# Altium schematic sheet Sensors.SchDoc
size A4; SheetNumber: 3; SheetTotal: 5
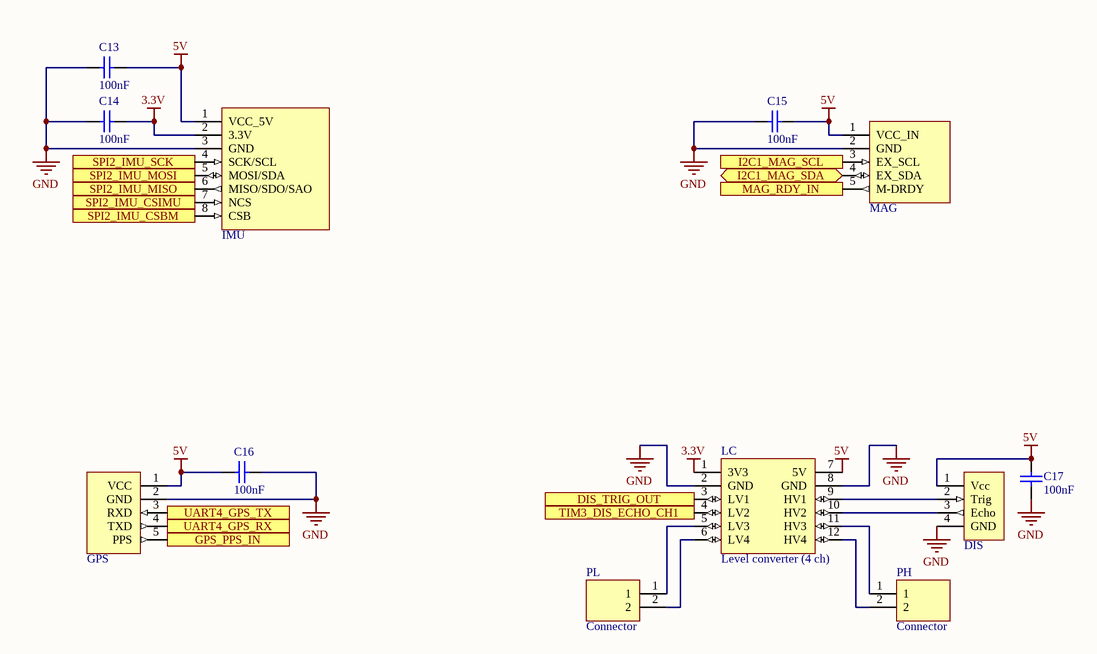
[diagram p0: Sensors.SchDoc]

## Parts
C13  100nF  [FP_0805_CAP_085]
C14  100nF  [FP_0805_CAP_085]
C15  100nF  [FP_0805_CAP_085]
C16  100nF  [FP_0805_CAP_085]
C17  100nF  [FP_0805_CAP_085]
DIS  Távolságérzékelő  [FP_CONN4_TUSKE_254MM]  (value not drawn)
GPS  GPS  [FP_CONN5_TUSKE_254MM]  (value not drawn)
IMU  IMU + Barométer  [GY-91]  (value not drawn)
LC  Level converter (4 ch)  [Level converter (4 ch)]
MAG  Iránytű, magnetométer  [GY-271]  (value not drawn)
PH  Connector  [FP_CONN2_TUSKE_254MM]
PL  Connector  [FP_CONN2_TUSKE_254MM]

## Ports
DIS_TRIG_OUT (in), GPS_PPS_IN (out), I2C1_MAG_SCL (in), I2C1_MAG_SDA (bidir), MAG_RDY_IN (out), SPI2_IMU_CSBM (in), SPI2_IMU_CSIMU (in), SPI2_IMU_MISO (out), SPI2_IMU_MOSI (in), SPI2_IMU_SCK (in), TIM3_DIS_ECHO_CH1 (out), UART4_GPS_RX (out), UART4_GPS_TX (in)

## Nets
3.3V: C14.2 IMU.2(3.3V) LC.1(3V3)
5V: C13.2 C15.2 C16.1 C17.2 DIS.1(Vcc) GPS.1(VCC) IMU.1(VCC_5V) LC.7(5V) MAG.1(VCC_IN)
GND: C13.1 C14.1 C15.1 C16.2 C17.1 DIS.4(GND) GPS.2(GND) IMU.3(GND) LC.2(GND) LC.8(GND) MAG.2(GND)
DIS_TRIG_OUT: LC.3(LV1) ; port DIS_TRIG_OUT
GPS_PPS_IN: GPS.5(PPS) ; port GPS_PPS_IN
I2C1_MAG_SCL: MAG.3(EX_SCL) ; port I2C1_MAG_SCL
I2C1_MAG_SDA: MAG.4(EX_SDA) ; port I2C1_MAG_SDA
MAG_RDY_IN: MAG.5(M-DRDY) ; port MAG_RDY_IN
SPI2_IMU_CSBM: IMU.8(CSB) ; port SPI2_IMU_CSBM
SPI2_IMU_CSIMU: IMU.7(NCS) ; port SPI2_IMU_CSIMU
SPI2_IMU_MISO: IMU.6(MISO/SDO/SAO) ; port SPI2_IMU_MISO
SPI2_IMU_MOSI: IMU.5(MOSI/SDA) ; port SPI2_IMU_MOSI
SPI2_IMU_SCK: IMU.4(SCK/SCL) ; port SPI2_IMU_SCK
TIM3_DIS_ECHO_CH1: LC.4(LV2) ; port TIM3_DIS_ECHO_CH1
UART4_GPS_RX: GPS.4(TXD) ; port UART4_GPS_RX
UART4_GPS_TX: GPS.3(RXD) ; port UART4_GPS_TX
NetDIS_2: DIS.2(Trig) LC.9(HV1)
NetDIS_3: DIS.3(Echo) LC.10(HV2)
NetLC_5: LC.5(LV3) PL.1
NetLC_6: LC.6(LV4) PL.2
NetLC_11: LC.11(HV3) PH.1
NetLC_12: LC.12(HV4) PH.2

## Library data of the parts
C13-C17 = CAP: Capacitor; Value: 100nF
DIS = HC-SR04-4P: Ultrahangos távolságérzékelő modul, 4P
GPS = NEO-7M-0-000: Ublox GPS modul EEPROM-mal C / AeroQuad-hoz, antennával NEO-7M 7N APM2.5 repülésvezérléshez
IMU = GY-91: 9DOF MPU9250 modul + BMP280, giroszkóp, gyorsulásmérő, iránytű, nyomásmérő, hőmérő, páratartalom mérő
LC = Level converter (4 ch): 4 channel level converter 3.3 <-> 5 V
MAG = GY-271: HMC5883L 3 tengelyes digitális iránytű (compass, magnetometer) I2C
PH PL = Connector_2pin: 2pin connector